# EasyEDA Pro project RinaBoard_V1_0.eprj, schematic MasterControl

## Sheets
1 MCU: Board Name: MasterControl; Create Date: 2024-11-25; Page Name: MCU; Project Name: RinaBoard; Schematic Name: MasterControl; Update Date: 2024-11-29; Company: 7Lab; Page Size: A4; Version: V1.0
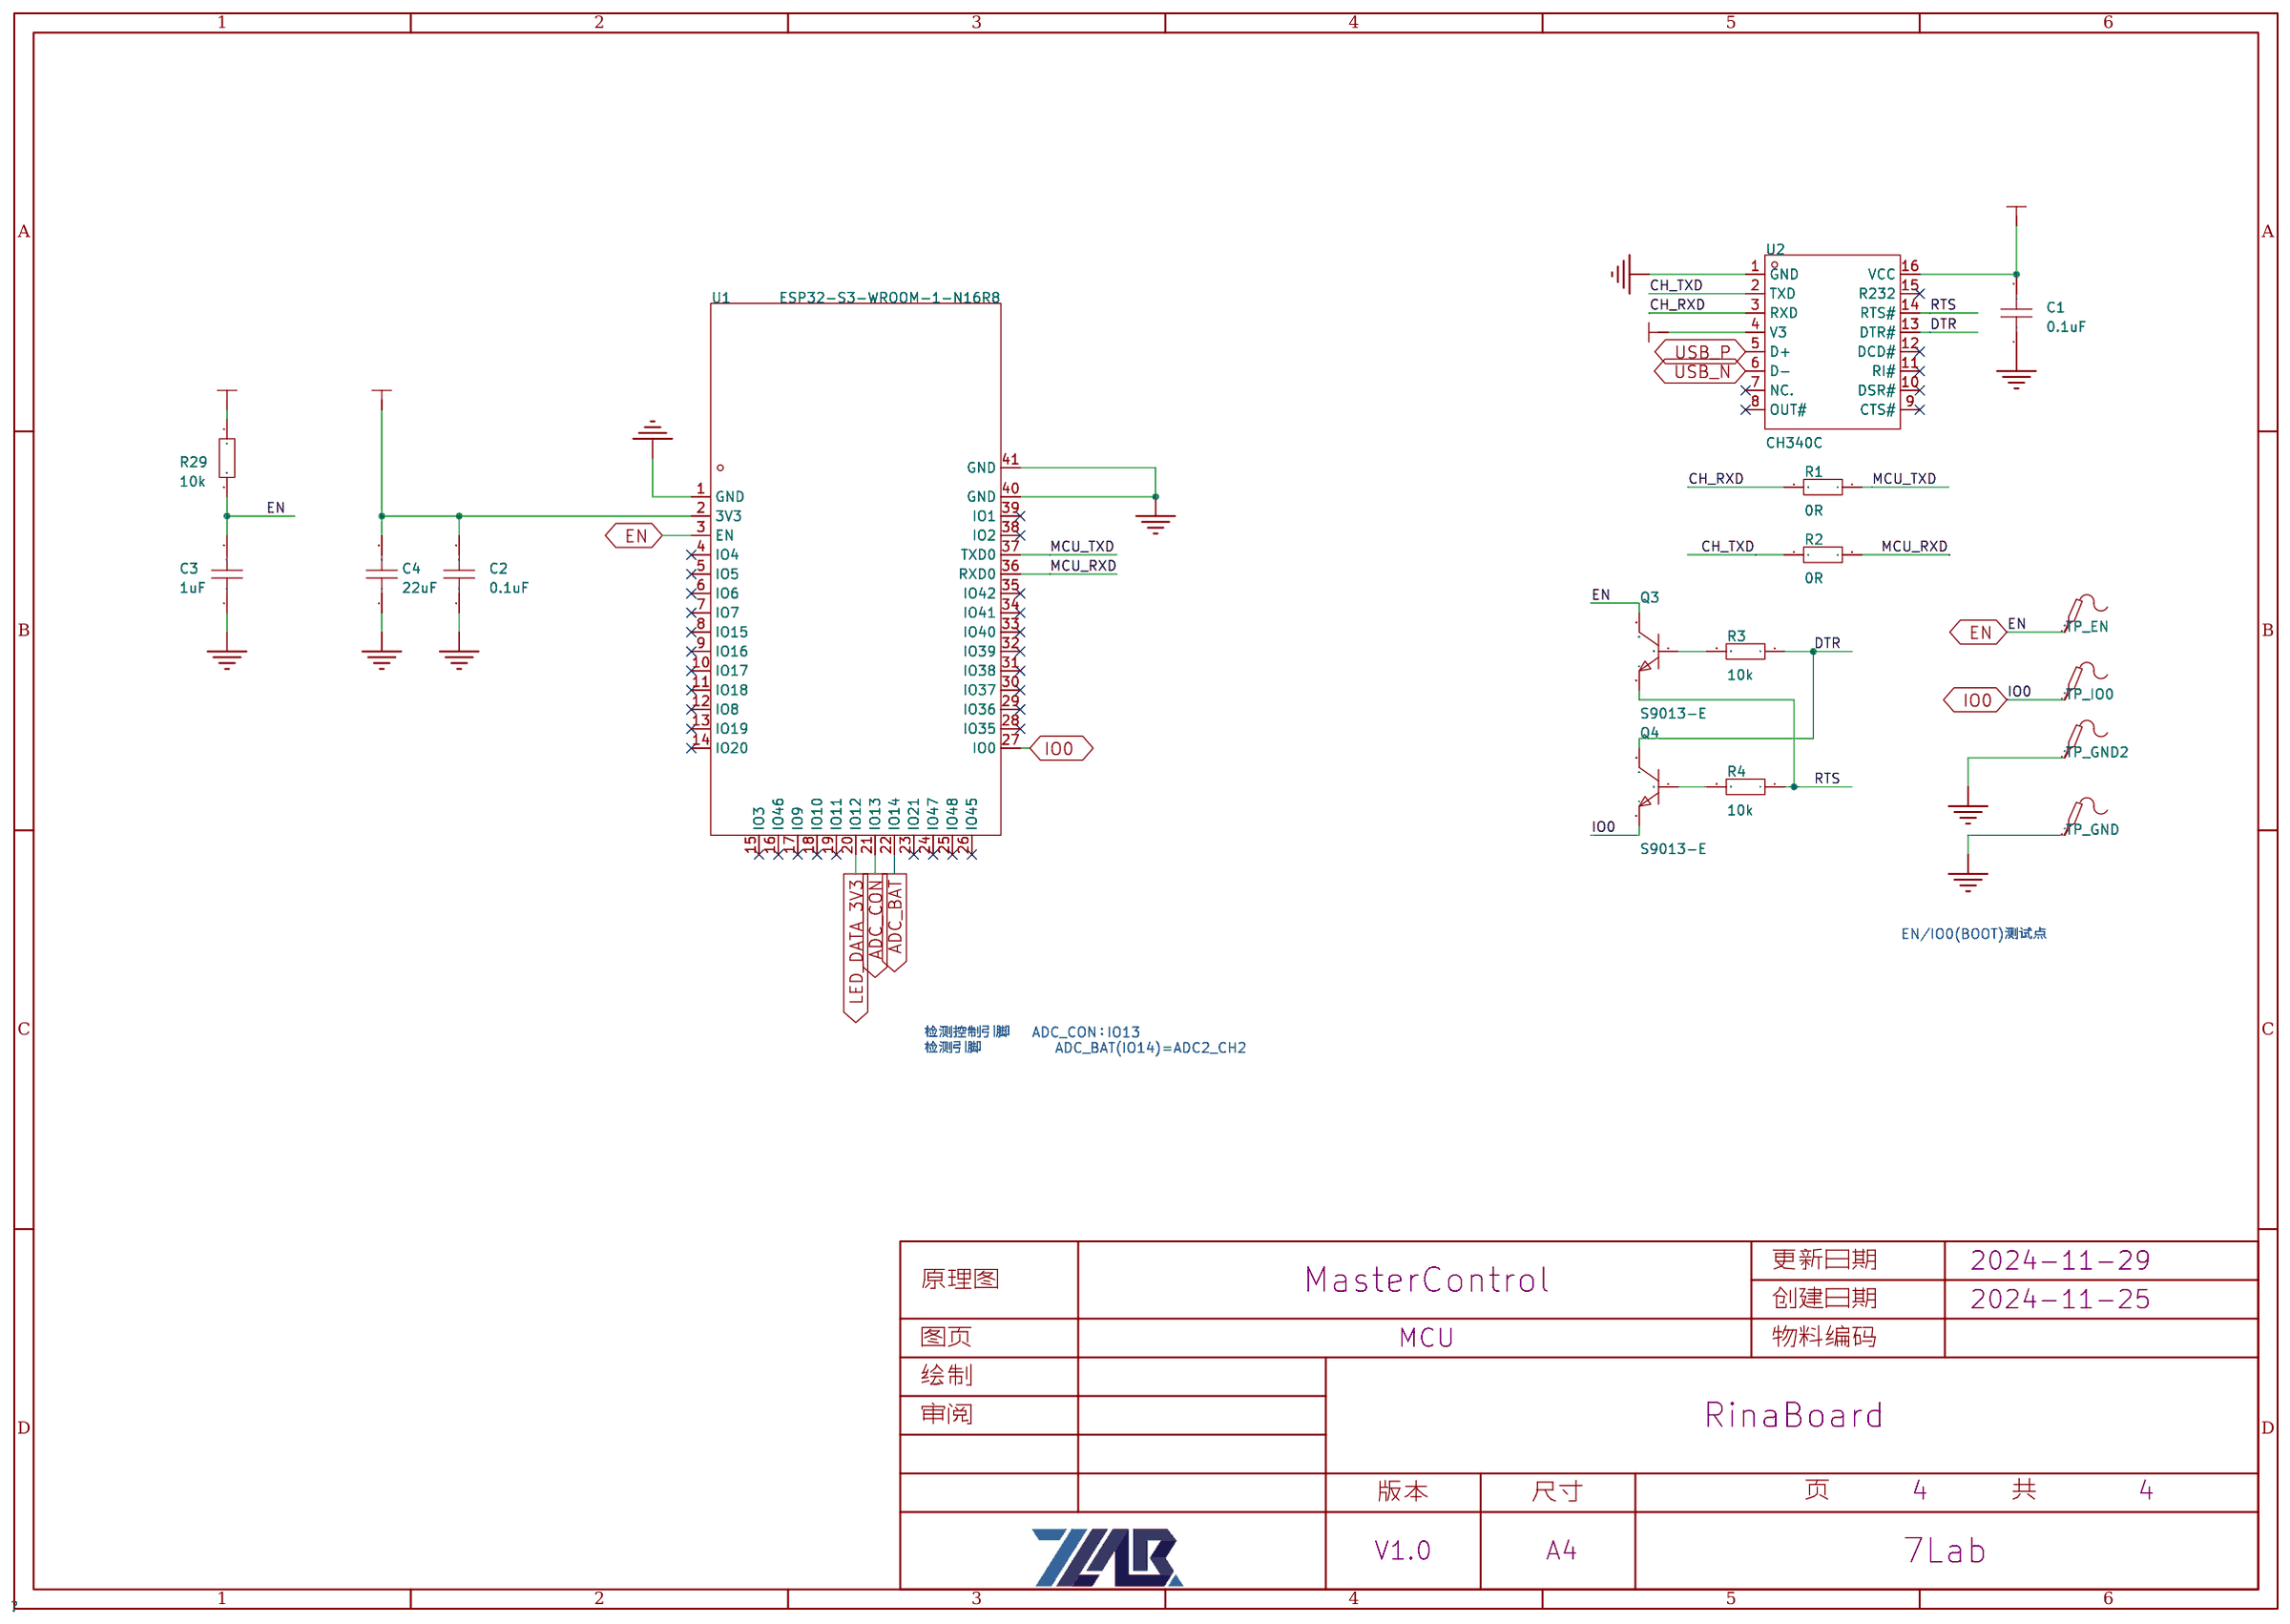
[diagram p1: MCU]
2 Power: Page Name: Power; Update Date: 2024-11-28; Reviewed: LYW
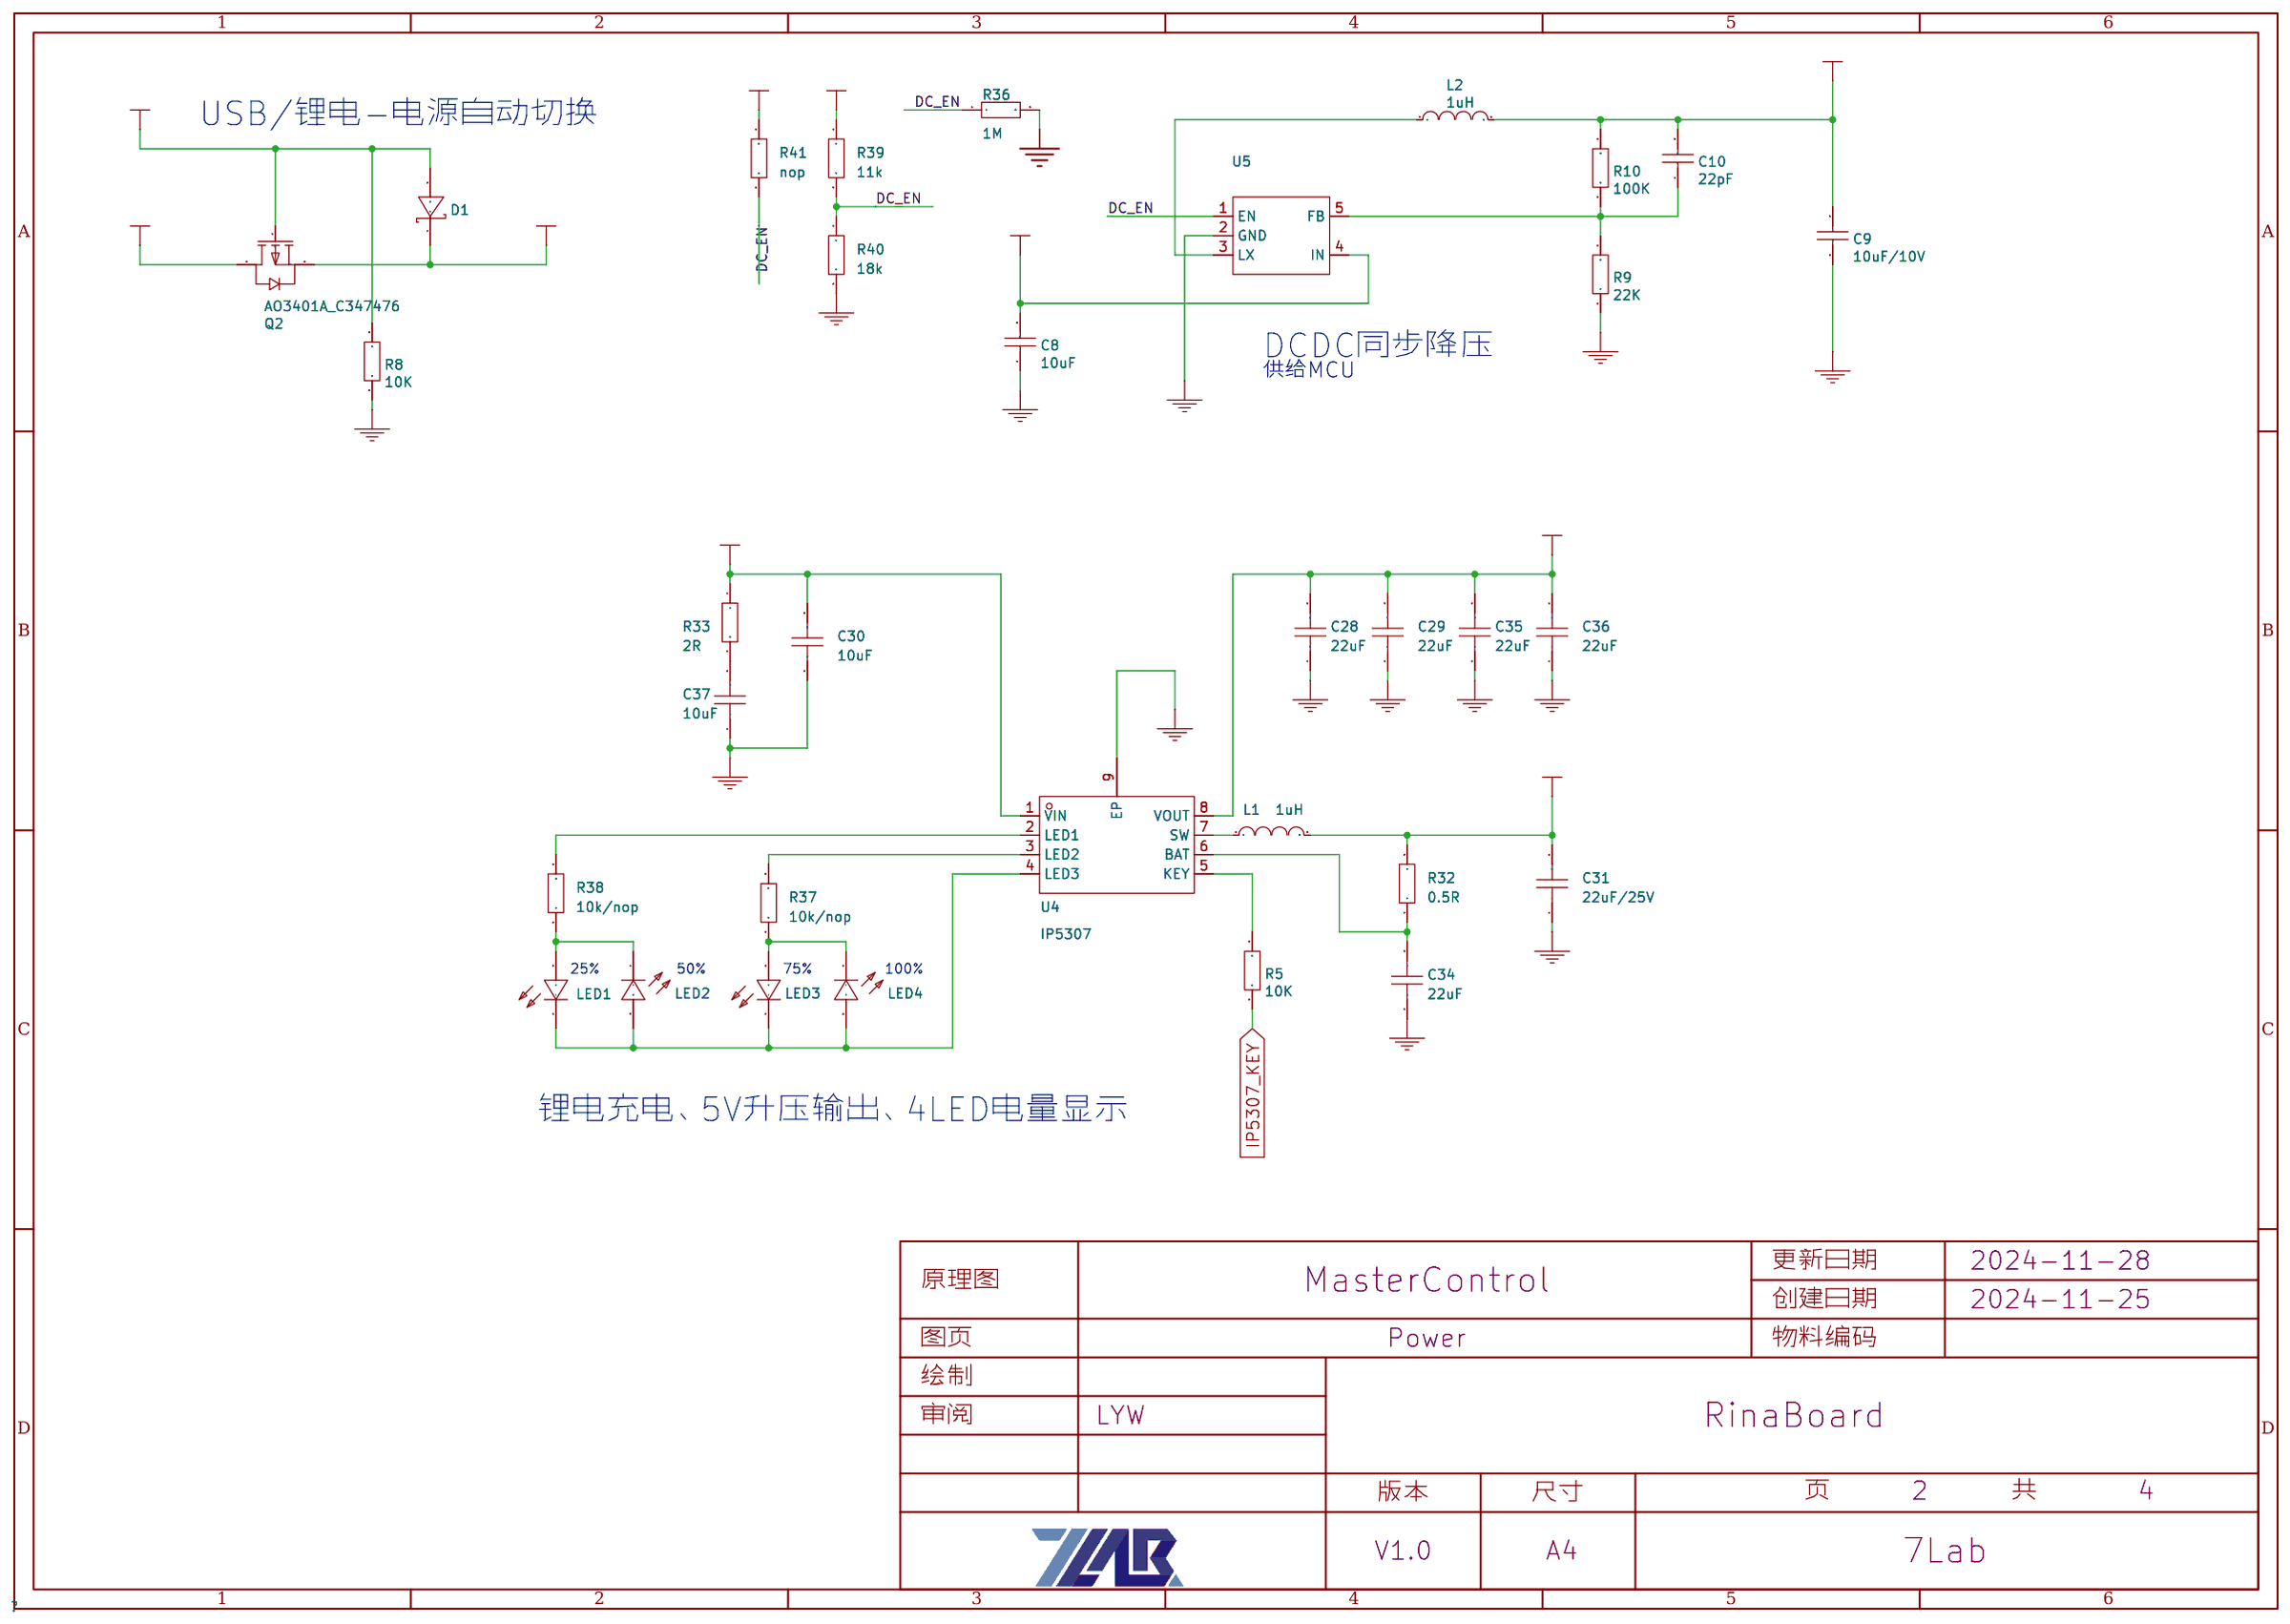
[diagram p2: Power]
3 Interface: Page Name: Interface
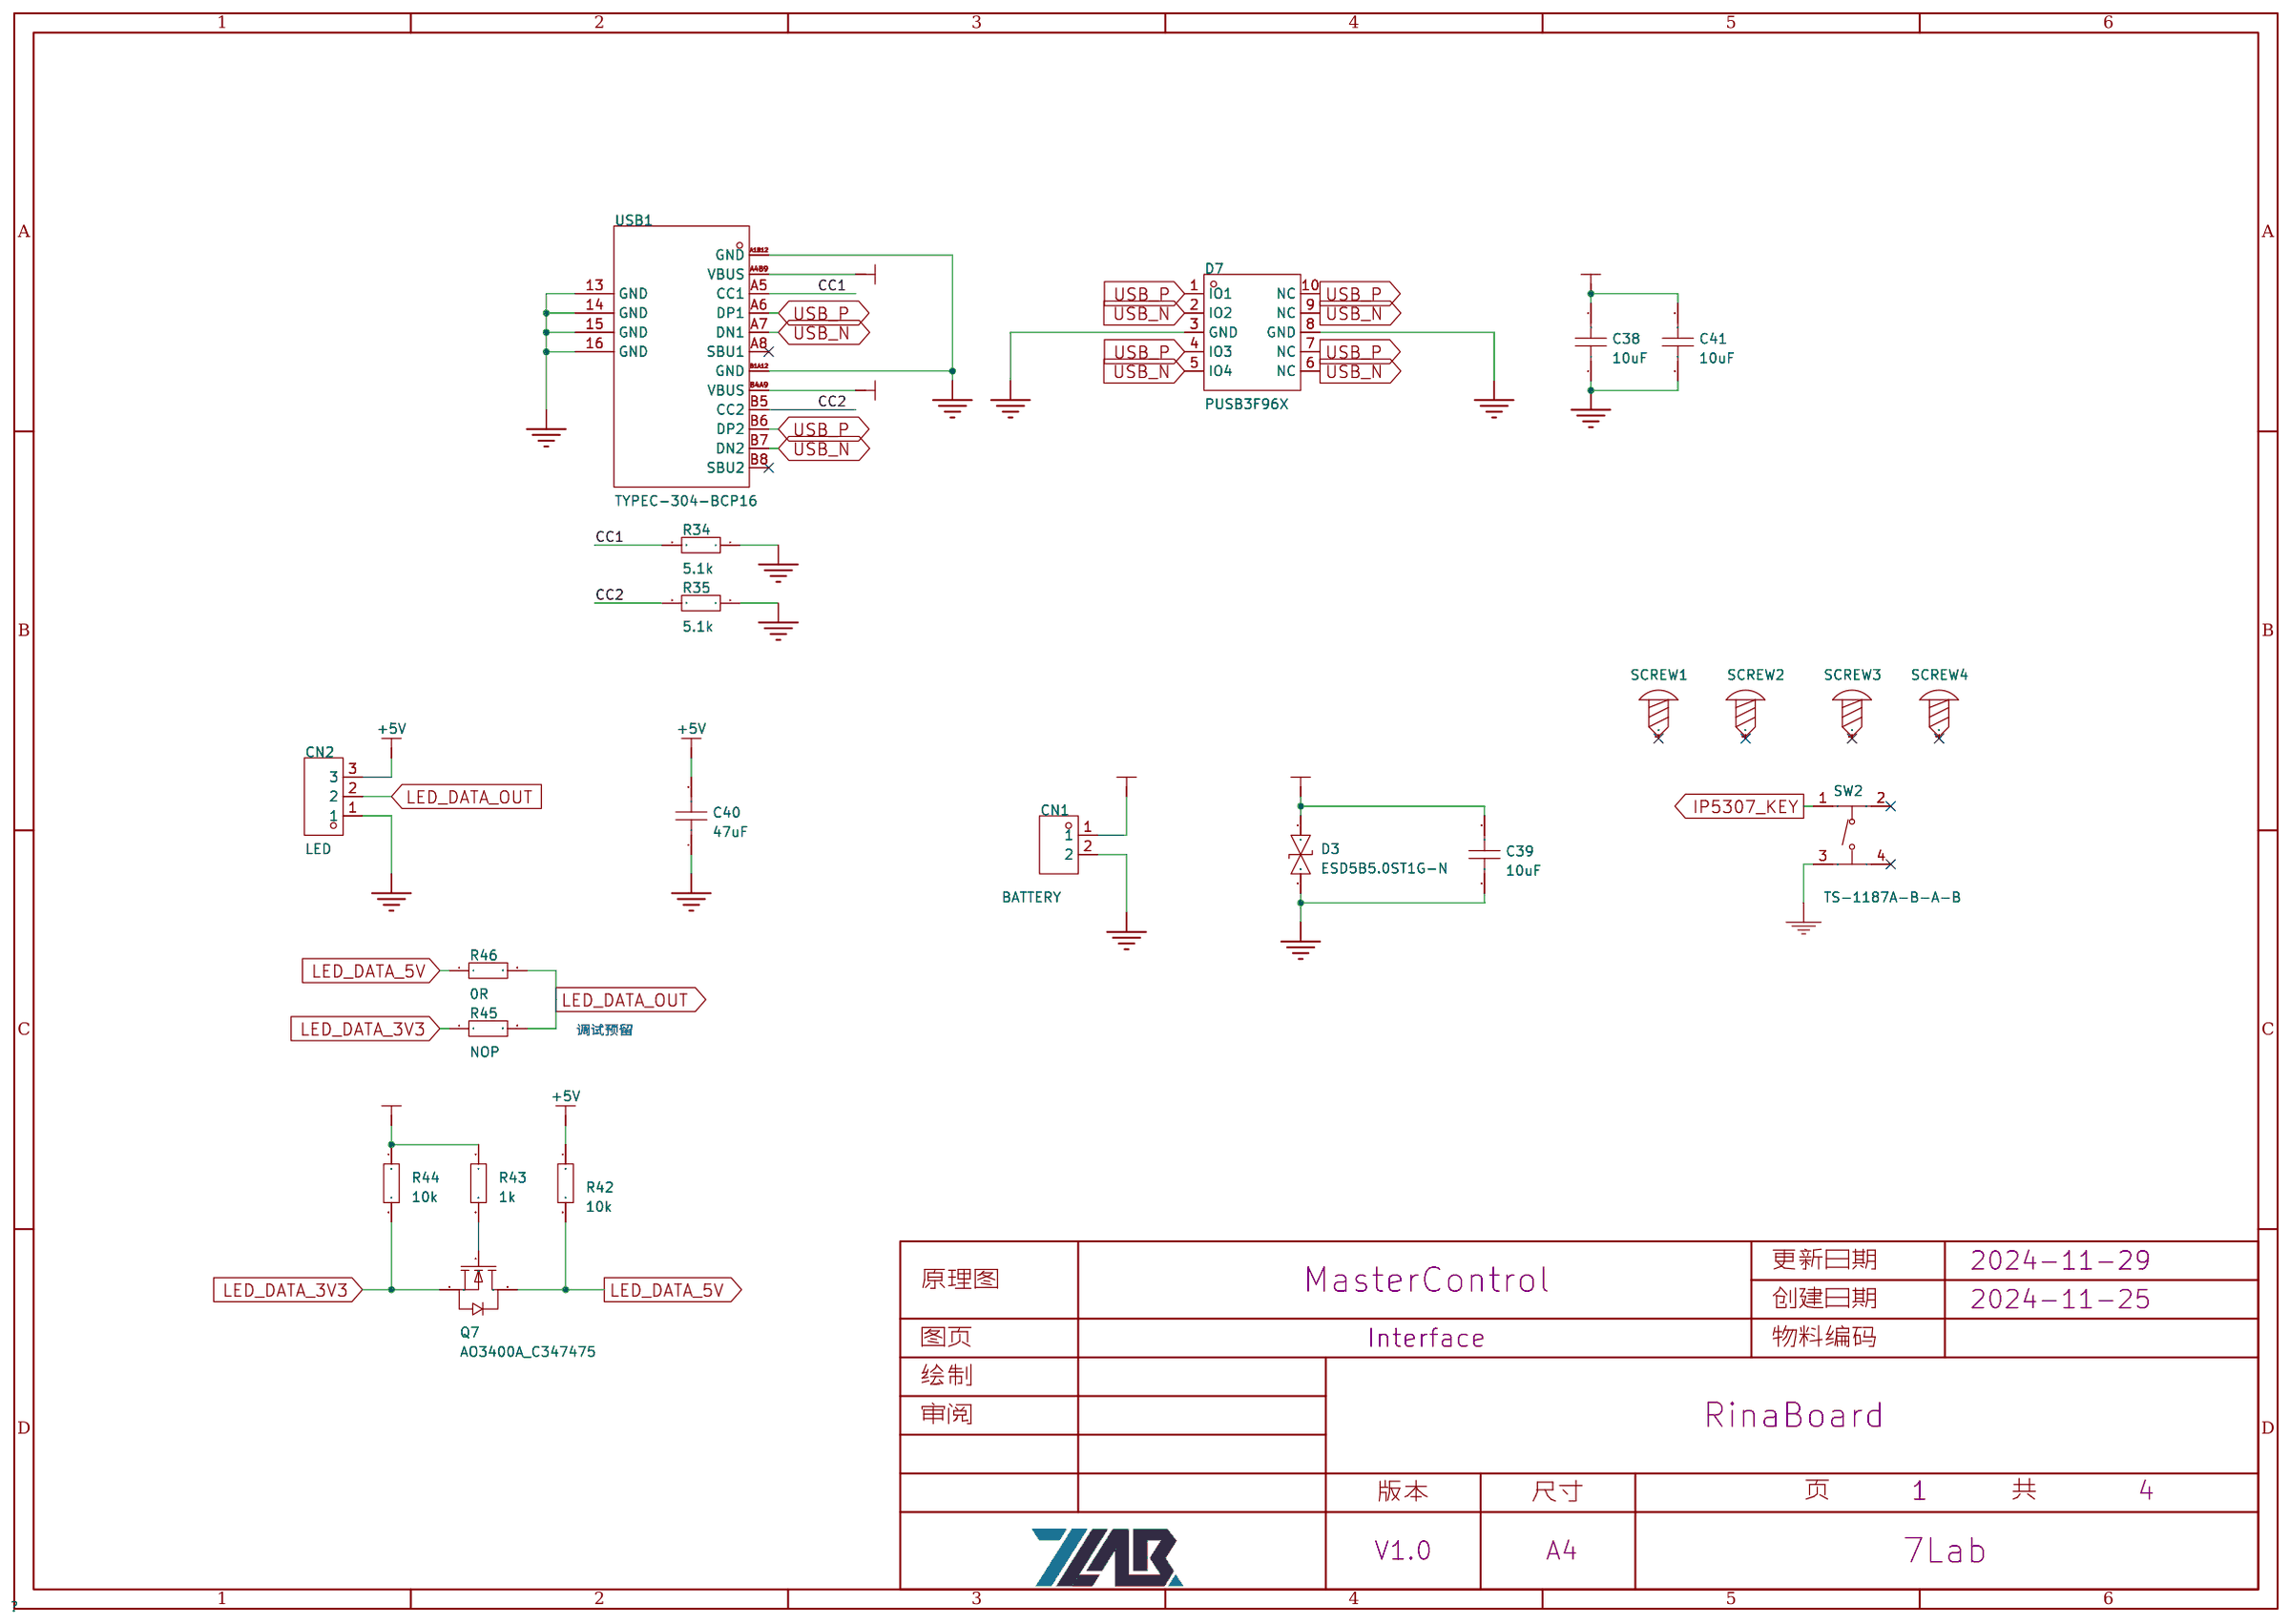
[diagram p3: Interface]
4 ADC: Board Name: Board2; Page Name: ADC; Update Date: 2024-11-27
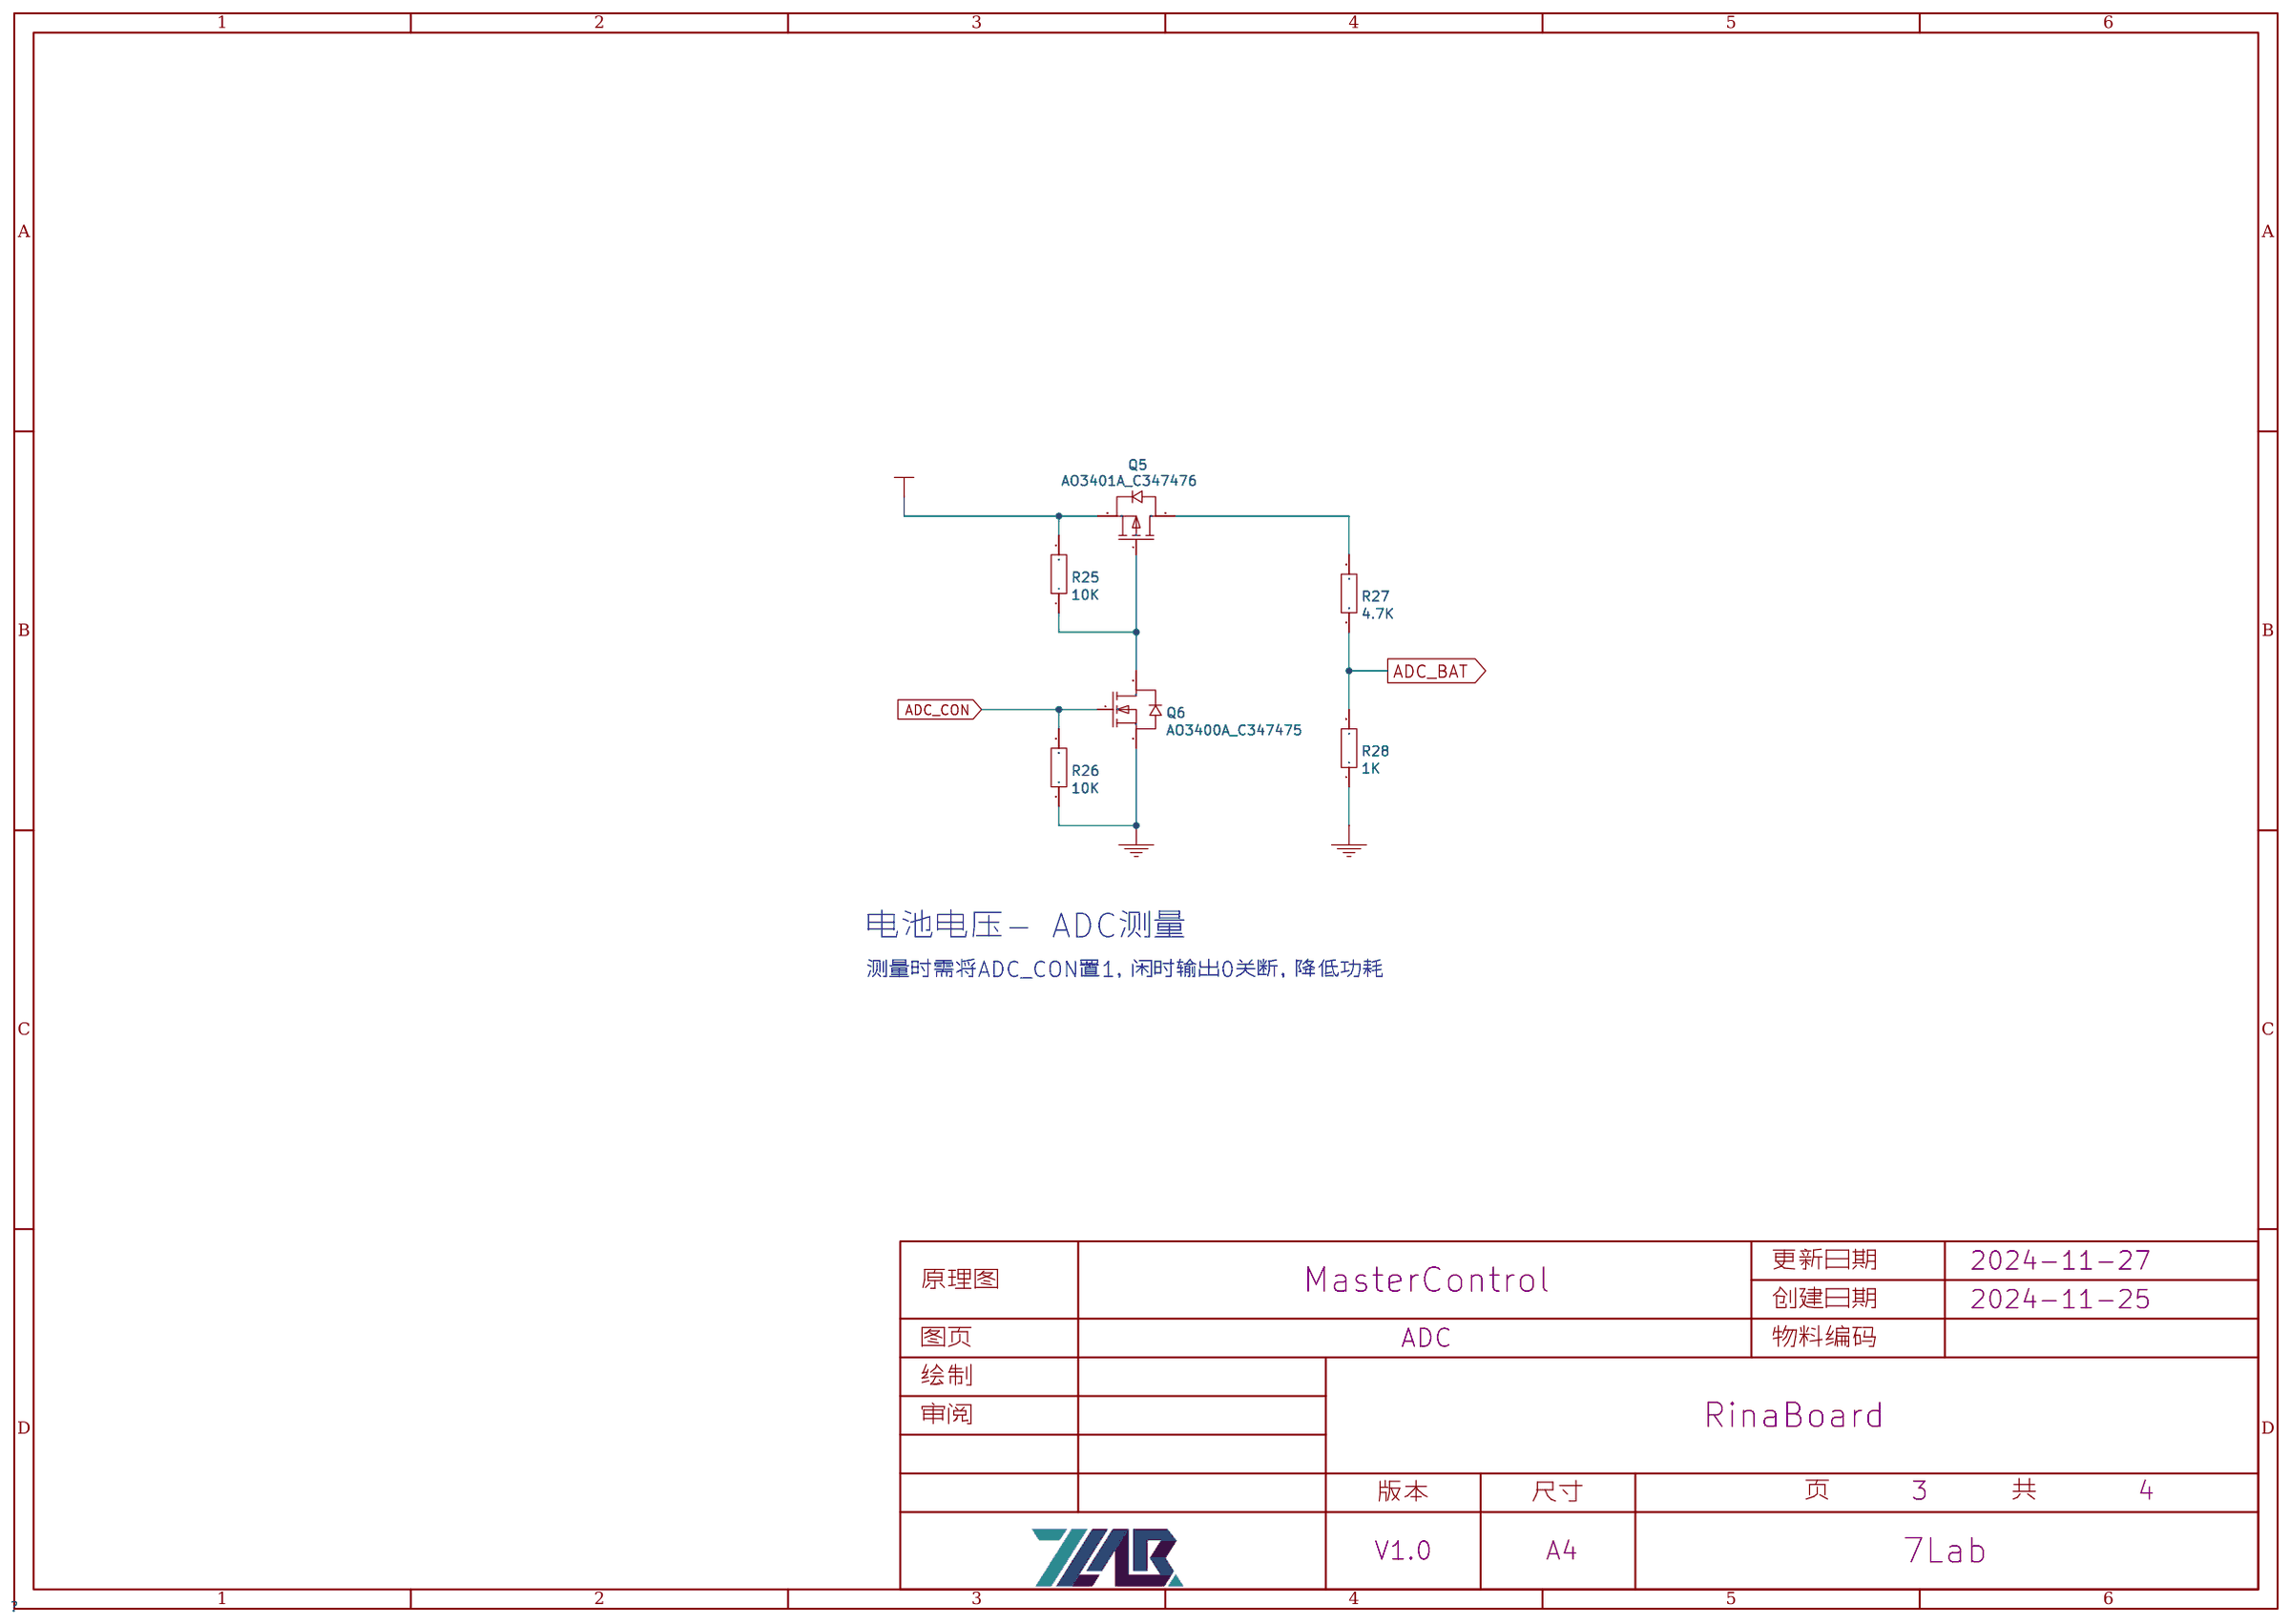
[diagram p4: ADC]

## Parts
sheet ADC
Q5  AO3401A_C347476  [AO3401A_SOT-23-3]
Q6  AO3400A_C347475  [AO3400A_SOT-23-3]
R25  10K  [R0603]
R26  10K  [R0603]
R27  4.7K  [R0603]
R28  1K  [R0603]
sheet Interface
C38  10uF  [C0603]
C39  10uF  [C0603]
C40  47uF  [C1206]
C41  10uF  [C0603]
CN1  BATTERY  [CONN-TH_2P-P2.50_HX25003-2A]
CN2  LED  [CONN-TH_3P-P2.54_2501S-3P]
D3  ESD5B5.0ST1G-N  [SOD-523_L1.2-W0.8-LS1.6-BI]
D7  PUSB3F96X  [DFN2510-10_L2.5-W1.0-P0.50-BL]
Q7  AO3400A_C347475  [AO3400A_SOT-23-3]
R34  5.1k  [R0603]
R35  5.1k  [R0603]
R42  10k  [R0603]
R43  1k  [R0603]
R44  10k  [R0603]
R45  NOP  [R0603]
R46  0R  [R0603]
SCREW1  -  [M2螺丝]
SCREW2  -  [M2螺丝]
SCREW3  -  [M2螺丝]
SCREW4  -  [M2螺丝]
SW2  TS-1187A-B-A-B  [SW-SMD_4P-L5.1-W5.1-P3.70-LS6.5-TL_H1.5]
USB1  TYPEC-304-BCP16  [USB-C-SMD_TYPEC-304-BCP16]
sheet MCU
C1  0.1uF  [C0603]
C2  0.1uF  [C0603]
C3  1uF  [C0603]
C4  22uF  [C0603]
Q3  S9013-E  [SOT-23-3_L2.9-W1.3-P1.90-LS2.4-BR]
Q4  S9013-E  [SOT-23-3_L2.9-W1.3-P1.90-LS2.4-BR]
R1  0R  [R0603]
R2  0R  [R0603]
R3  10k  [R0603]
R4  10k  [R0603]
R29  10k  [R0603]
TP_EN  -  [Test-Point-0.5mm]
TP_GND  -  [Test-Point-0.5mm]
TP_GND2  -  [Test-Point-0.5mm]
TP_IO0  -  [Test-Point-0.5mm]
U1  ESP32-S3-WROOM-1-N16R8  [WIRELM-SMD_ESP32-S3-WROOM-1]
U2  CH340C  [SOP-16_L10.0-W3.9-P1.27-LS6.0-BL]
sheet Power
C8  10uF  [C0603]
C9  10uF/10V  [C0603]
C10  22pF  [C0603]
C28  22uF  [C0603]
C29  22uF  [C0603]
C30  10uF  [C0603]
C31  22uF/25V  [C0603]
C34  22uF  [C0603]
C35  22uF  [C0603]
C36  22uF  [C0603]
C37  10uF  [C0603]
D1  DSK34  [SOD-123_L2.8-W1.8-LS3.7-RD]
L1  1uH  [IND-SMD_L7.1-W6.6_MJC-0603T]
L2  1uH  [IND-SMD_L7.1-W6.6_MJC-0603T]
LED1  FC-DA1608BK-470H10  [LED0603-RD_WHITE]
LED2  FC-DA1608BK-470H10  [LED0603-RD_WHITE]
LED3  FC-DA1608BK-470H10  [LED0603-RD_WHITE]
LED4  FC-DA1608BK-470H10  [LED0603-RD_WHITE]
Q2  AO3401A_C347476  [AO3401A_SOT-23-3]
R5  10K  [R0603]
R8  10K  [R0603]
R9  22K  [R0603]
R10  100K  [R0603]
R32  0.5R  [R0805]
R33  2R  [R0603]
R36  1M  [R0603]
R37  10k/nop  [R0603]
R38  10k/nop  [R0603]
R39  11k  [R0603]
R40  18k  [R0603]
R41  nop  [R0603]
U4  IP5307  [ESOP-8_L4.9-W3.9-P1.27-LS6.0-BL-EP]
U5  SY8089A1AAC  [TSOT-23-5_L2.9-W1.6-P0.95-LS2.8-BR]

## Library data of the parts
Q2 Q5 = AO3401A_C347476: Supplier: LCSC; Supplier Part: C347476; Manufacturer: Youtai Semiconductor Co., Ltd.; Manufacturer Part: AO3401A; JLCPCB Part Class: Extended Part
Q6 Q7 = AO3400A_C347475: Supplier: LCSC; Supplier Part: C347475; Manufacturer: Youtai Semiconductor Co., Ltd.; Manufacturer Part: AO3400A; JLCPCB Part Class: Extended Part
R5 R8 R25 R26 = 10K: Supplier: LCSC; Manufacturer: UniOhm; Manufacturer Part: 0402WGF1002TCE; Supplier Part: C25744; JLCPCB Part Class: Basic Part
R27 = 4.7K: Supplier: LCSC; Manufacturer: UniOhm; Manufacturer Part: 0402WGF4701TCE; Supplier Part: C25900; JLCPCB Part Class: Basic Part
R28 R32 R34 R35 R37 R38 = 1K: Supplier: LCSC; Manufacturer: UniOhm; Manufacturer Part: 0402WGF1001TCE; Supplier Part: C11702; JLCPCB Part Class: Basic Part
C38-C41 = CGA1206X5R226M350NT: LCSC Part Name: 22uF ±20% 35V; Supplier Part: C6119969; Manufacturer: HRE(芯声); Supplier Footprint: 1206; JLCPCB Part Class: 扩展库; Supplier: LCSC; Tolerance: ±20%; Voltage Rated: 35V; Temperature Coefficient: X5R
CN1 = ZX-XH2.54-2PZZ: Supplier Part: C7429632; Manufacturer: Megastar(兆星); Supplier Footprint: 插件,P=2.54mm; JLCPCB Part Class: 扩展库; Datasheet: https://atta.szlcsc.com/upload/public/pdf/source/20230619/19BA6947230AA44A04D3EDD65E618FD0.pdf; Supplier: LCSC; Pins Structure: 1x2P; Pitch: 2.54mm; Mounting Style: 直插; Reference Series: XH; Number of Pins: 2P; Number of Rows: 1; Number of PINs Per Row: 2; Current Rating (Max): 3A; Contact Material: 黄铜; Contact Plating: 锡; Operating Temperature Range: -25℃~+85℃
CN2 = ZX-XH2.54-3PZZ: Supplier Part: C7429633; Manufacturer: Megastar(兆星); Supplier Footprint: 插件,P=2.54mm; JLCPCB Part Class: 扩展库; Datasheet: https://atta.szlcsc.com/upload/public/pdf/source/20230619/AE17037A2CFDBE8D9CBA775D61AD0A84.pdf; Supplier: LCSC; Pins Structure: 1x3P; Pitch: 2.54mm; Mounting Style: 直插; Reference Series: XH; Number of Pins: 3P; Number of Rows: 1; Number of PINs Per Row: 3; Current Rating (Max): 3A; Contact Material: 黄铜; Contact Plating: 锡; Operating Temperature Range: -25℃~+85℃
D3 = ESD5B5.0ST1G-N: Supplier Part: C316038; Manufacturer: BORN(伯恩半导体); Supplier Footprint: SOD-523; JLCPCB Part Class: 扩展库; Datasheet: https://atta.szlcsc.com/upload/public/pdf/source/20181025/C316038_E957C7145DFD1856B4D4AE56945D7135.pdf; Supplier: LCSC
D7 = PUSB3F96X: Supplier Part: C2923351; Manufacturer: TECH PUBLIC(台舟); Supplier Footprint: DFN2510-10; JLCPCB Part Class: 扩展库; Datasheet: https://atta.szlcsc.com/upload/public/pdf/source/20211124/9616B0FCC16B516782F41C88373BE328.pdf; Supplier: LCSC
R1-R4 R29 R33 R42-R46 = Res_0603: Supplier Footprint: 0603
SCREW1-SCREW4 = M2螺丝: Supplier Footprint: 插件
SW2 = TS-1187A-B-A-B: LCSC Part Name: 5.1*5.1*1.5mm 立贴 轻触开关; Supplier Part: C318884; Manufacturer: XKB Connectivity(中国星坤); Supplier Footprint: SMD; JLCPCB Part Class: 基础库; Datasheet: https://atta.szlcsc.com/upload/public/pdf/source/20200227/C318890_053E50208A88A7BA1965D8746000774E.pdf; Supplier: LCSC; Circuit: 单刀单掷; Actuator Style: 圆形按钮; Operating Force: 160gf; Mounting Style: 立贴; Switch Length: 5.1mm; Switch Width: 5.1mm; Switch Height: 1.5mm; Strike Gundam: 不带; Contact Current: 50mA; Voltage Rating (DC): 12V; Actuator/Cap Color: 金色; With Lamp: 无; Mechanical Life: 10万次; Operating Temperature: -30℃~+85℃; Component Height: 7
USB1 = TYPEC-304-BCP16_C720629: LCSC Part Name: Type-C 母 卧贴 停产; Supplier Part: C720629; Manufacturer: XUNPU(讯普); Supplier Footprint: SMD; JLCPCB Part Class: Extended Part; Datasheet: https://atta.szlcsc.com/upload/public/pdf/source/20220210/1FE0FEFF7D6A20C111212527D3DED014.pdf; Supplier: LCSC; Connector Type: Type-C; Standard: USB 3.1; Gender: 母; Number of Ports: 1; Number of Contacts: 16P; Mounting Style: 卧贴; Current Rating - Power (Max): 3A; Operating Temperature Range: -25℃~+85℃; Soldering Temperature(Max): 260℃
C1-C4 C34 C37 = CAP_0603: Supplier Footprint: 0603
Q3 Q4 = S9013-E: LCSC Part Name: NPN 电流:500mA 耐压:25V; Supplier Part: C41371419; Manufacturer: MDD(辰达半导体); Supplier Footprint: SOT-23; JLCPCB Part Class: 扩展库; Datasheet: https://atta.szlcsc.com/upload/public/pdf/source/20241113/4DDBD2B8A7B6A974495B9B970C95E559.pdf; Supplier: LCSC; Transistor Type: NPN; Collector Current (Ic): 500mA; Collector-Emitter Breakdown Voltage (Vceo): 25V; Power Dissipation (Pd): 300mW; DC Current Gain (hFE@Ic,Vce): 120@50mA,1V; Transition Frequency (fT): 150MHz; Collector Cut-Off Current (Icbo): 100nA; Collector-Emitter Saturation Voltage (VCE(sat)@Ic,Ib): 600mV@500mA,50mA; Operating Temperature: -55℃~+150℃
TP_EN TP_GND TP_GND2 TP_IO0 = Test-Point
U1 = ESP32-S3-WROOM-1-N16R8: LCSC Part Name: 通用型Wi-Fi+低功耗蓝牙MCU模组; Supplier Part: C2913202; Manufacturer: ESPRESSIF(乐鑫); Supplier Footprint: SMD,18x25.5mm; JLCPCB Part Class: 扩展库; Datasheet: https://atta.szlcsc.com/upload/public/pdf/source/20220705/4E799F39581577F766659887F738A439.pdf; Supplier: LCSC
U2 = CH340C: LCSC Part Name: CH340C USB转串口芯片 CH340; Supplier Part: C84681; Manufacturer: WCH(南京沁恒); Supplier Footprint: SOP-16; JLCPCB Part Class: 扩展库; Datasheet: https://atta.szlcsc.com/upload/public/pdf/source/20200819/C84681_ADBED554CE321879DBD6B1D06488689C.pdf; Supplier: LCSC; Applications Function: 收发器; Protocol: USB 2.0; Supply Voltage: 3.3V；5V; Data Rate: 2Mbps
C8 C9 = 10uF: Supplier: LCSC; Manufacturer Part: CL05A106MQ5NUNC; Manufacturer: SAMSUNG; Supplier Part: C15525; JLCPCB Part Class: Basic Part
C10 = 22pF: Supplier: LCSC; Manufacturer: FH; Manufacturer Part: 0402CG220J500NT; Supplier Part: C1555; JLCPCB Part Class: Basic Part
C28-C31 C35 C36 = HGC1206R5106K500NSPJ: LCSC Part Name: 10uF ±10% 50V; Supplier Part: C7432781; Manufacturer: Chinocera(华瓷); Supplier Footprint: 1206; JLCPCB Part Class: 扩展库; Datasheet: https://atta.szlcsc.com/upload/public/pdf/source/20240320/FAC3FEC40A78BC5CCCE96C232A94D860.pdf; Supplier: LCSC; Tolerance: ±10%; Voltage Rated: 50V; Temperature Coefficient: X5R
D1 = DSK34_C41029: LCSC Part Name: 电压:40V 电流:3A; Supplier Part: C41029; Manufacturer: MDD(辰达半导体); Supplier Footprint: SOD-123FL; JLCPCB Part Class: Extended Part; Datasheet: https://atta.szlcsc.com/upload/public/pdf/source/20240710/931B7979AEEE628A0AE48522F9F6A0BB.pdf; Supplier: LCSC; Diode Configuration: 独立式; Forward Voltage (Vf@If): 550mV@3A; Reverse Voltage (Vr): 40V; Rectified Current: 3A; Reverse Leakage Current (Ir): 500uA@40V
L1 = 1uH: Supplier: LCSC; Manufacturer: Sunlord; Manufacturer Part: WPN4020H1R0MT; Supplier Part: C98359; JLCPCB Part Class: Extended Part
L2 = 2.2uH: Supplier: LCSC; Manufacturer: Sunlord; Manufacturer Part: WPN4020H2R2MT; Supplier Part: C98361; JLCPCB Part Class: Extended Part
LED1-LED4 = FC-DA1608BK-470H10: Supplier: LCSC; Manufacturer: NATIONSTAR; Supplier Part: C84266; JLCPCB Part Class: Extended Part
R9 = 22K: Supplier: LCSC; Manufacturer: UniOhm; Manufacturer Part: 0402WGF2202TCE; Supplier Part: C25768; JLCPCB Part Class: Basic Part
R10 R36 R39-R41 = 100K: Supplier: LCSC; Manufacturer: UniOhm; Manufacturer Part: 0402WGF1003TCE; Supplier Part: C25741; JLCPCB Part Class: Basic Part
U4 = IP5306: Supplier Part: C181692; Manufacturer: INJOINIC(英集芯); Supplier Footprint: ESOP-8; JLCPCB Part Class: 扩展库; Datasheet: https://atta.szlcsc.com/upload/public/pdf/source/20190627/C384572_9925B3DDC4041BC6108E5AB46A2A0AB1.pdf; Supplier: LCSC
U5 = SY8089A1AAC: Supplier Part: C479074; Manufacturer: silergy(矽力杰); Supplier Footprint: SOT-23-5; JLCPCB Part Class: Extended Part; Datasheet: https://atta.szlcsc.com/upload/public/pdf/source/20200117/C479074_09E605B8BDE11DB5A08573B7E6429A0D.pdf; Supplier: LCSC

## Nets
+3V3: C1.2 C2.2 C4.2 C9.2 C10.2 L2.2 R10.2 R29.1 R43.1 R44.1 U1.2(3V3) U2.4(V3) U2.16(VCC)
+5V: C28.2 C29.2 C35.2 C36.2 C40.2 CN2.3 R39.1 R42.1 U4.8(VOUT)
GND: C1.1 C2.1 C3.1 C4.1 C8.1 C9.1 C28.1 C29.1 C30.1 C31.1 C34.1 C35.1 C36.1 C37.1 C38.1 C39.1 C40.1 C41.1 CN1.2 CN2.1 D3.2 D7.3(GND) D7.8(GND) Q6.2(S) R8.1 R9.1 R26.1 R28.1 R34.1 R35.1 R36.2 R40.2 SW2.3(C) TP_GND.1 TP_GND2.1 U1.1(GND) U1.40(GND) U1.41(GND) U2.1(GND) U4.9(EP) U5.2(GND) USB1.13(GND) USB1.14(GND) USB1.15(GND) USB1.16(GND) USB1.A1B12(GND) USB1.B1A12(GND)
VBAT: C31.2 C39.2 CN1.1 D3.1 L1.2 Q2.3(D) Q5.2(S) R25.2 R32.2
VBUS: C30.2 C38.2 C41.2 D1.2(A) Q2.1(G) R8.2 R33.1 U4.1(VIN) USB1.A4B9(VBUS) USB1.B4A9(VBUS)
VIN: C8.2 D1.1(K) Q2.2(S) R41.1 U5.4(IN)
ADC_BAT: R27.1 R28.2 U1.22(IO14)
ADC_CON: Q6.1(G) R26.2 U1.21(IO13)
CC1: R34.2 USB1.A5(CC1)
CC2: R35.2 USB1.B5(CC2)
CH_RXD: R1.2 U2.3(RXD)
CH_TXD: R2.1 U2.2(TXD)
DC_EN: R36.1 R39.2 R40.1 R41.2 U5.1(EN)
DTR: Q4.3(C) R3.1 U2.13(DTR#)
EN: C3.2 Q3.3(C) R29.2 TP_EN.1 U1.3(EN)
IO0: Q4.2(E) TP_IO0.1 U1.27(IO0)
IP5307_KEY: R5.1 SW2.1(A)
LED_DATA_3V3: Q7.2(S) R44.2 R45.1 U1.20(IO12)
LED_DATA_5V: Q7.3(D) R42.2 R46.1
LED_DATA_OUT: CN2.2 R45.2 R46.2
MCU_RXD: R2.2 U1.36(RXD0)
MCU_TXD: R1.1 U1.37(TXD0)
RTS: Q3.2(E) R4.1 U2.14(RTS#)
USB_N: D7.2(IO2) D7.5(IO4) D7.6(NC) D7.9(NC) U2.6(D-) USB1.A7(DN1) USB1.B7(DN2)
USB_P: D7.1(IO1) D7.4(IO3) D7.7(NC) D7.10(NC) U2.5(D+) USB1.A6(DP1) USB1.B6(DP2)
$1N2176: Q3.1(B) R3.2
$1N2324: Q4.1(B) R4.2
$2N521: L1.1 U4.7(SW)
$2N524: R5.2 U4.5(KEY)
$2N1221: C34.2 R32.1 U4.6(BAT)
$2N1458: LED1.1(-) LED2.2(+) LED3.1(-) LED4.2(+) U4.4(LED3)
$2N2157: C37.2 R33.2
$2N3725: L2.1 U5.3(LX)
$2N3729: C10.1 R9.2 R10.1 U5.5(FB)
$2N5657: R37.2 U4.3(LED2)
$2N5662: LED3.2(+) LED4.1(-) R37.1
$2N5690: R38.2 U4.2(LED1)
$2N5696: LED1.2(+) LED2.1(-) R38.1
$3N4901: Q7.1(G) R43.2
$4N342: Q5.3(D) R27.2
$4N345: Q5.1(G) Q6.3(D) R25.1

Not connected (* = marked no-connect by the designer): SCREW1 1*; SCREW2 1*; SCREW3 1*; SCREW4 1*; SW2 2(B)* 4(D)*; U1 4(IO4)* 5(IO5)* 6(IO6)* 7(IO7)* 8(IO15)* 9(IO16)* 10(IO17)* 11(IO18)* 12(IO8)* 13(IO19)* 14(IO20)* 15(IO3)* 16(IO46)* 17(IO9)* 18(IO10)* 19(IO11)* 23(IO21)* 24(IO47)* 25(IO48)* 26(IO45)* 28(IO35)* 29(IO36)* 30(IO37)* 31(IO38)* 32(IO39)* 33(IO40)* 34(IO41)* 35(IO42)* 38(IO2)* 39(IO1)*; U2 7(NC.)* 8(OUT#)* 9(CTS#)* 10(DSR#)* 11(RI#)* 12(DCD#)* 15(R232)*; USB1 A8(SBU1)* B8(SBU2)*

## Notes on the sheets
sheet 1
- EN/IO0(BOOT)测试点
- 检测控制引脚   ADC_CON：IO13
  检测引脚          ADC_BAT(IO14)=ADC2_CH2
sheet 2
- USB/锂电-电源自动切换
- DCDC同步降压
- 供给MCU
- 25%
- 50%
- 75%
- 100%
- 锂电充电、5V升压输出、4LED电量显示
sheet 3
- 调试预留
sheet 4
- 电池电压- ADC测量
- 测量时需将ADC_CON置1，闲时输出0关断，降低功耗
